# Altium schematic sheet LightSensor.SchDoc
size A4
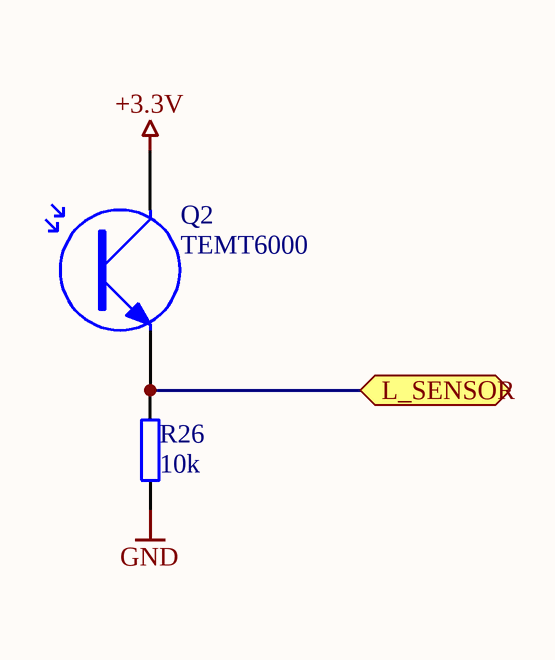
[diagram p0: LightSensor.SchDoc]

## Parts
Q2  TEMT6000  [TEMT600]
R26  10k  [RES 0805]

## Ports
L_SENSOR (bidir)

## Nets
+3.3V: Q2.1(C)
GND: R26.2
L_SENSOR: Q2.2(E) R26.1 ; port L_SENSOR

## Library data of the parts
Q2 = TEMT6000: Light sensor; Name: TEMT6000; Datasheet: https://www.sparkfun.com/datasheets/Sensors/Imaging/TEMT6000.pdf
R26 = RES: RESISTOR; REFERENCE ID: *; DISTRIBUTOR: *; VALUE: 10k